# EAGLE design ToolChestAutoLight (EAGLE 9.5.2)
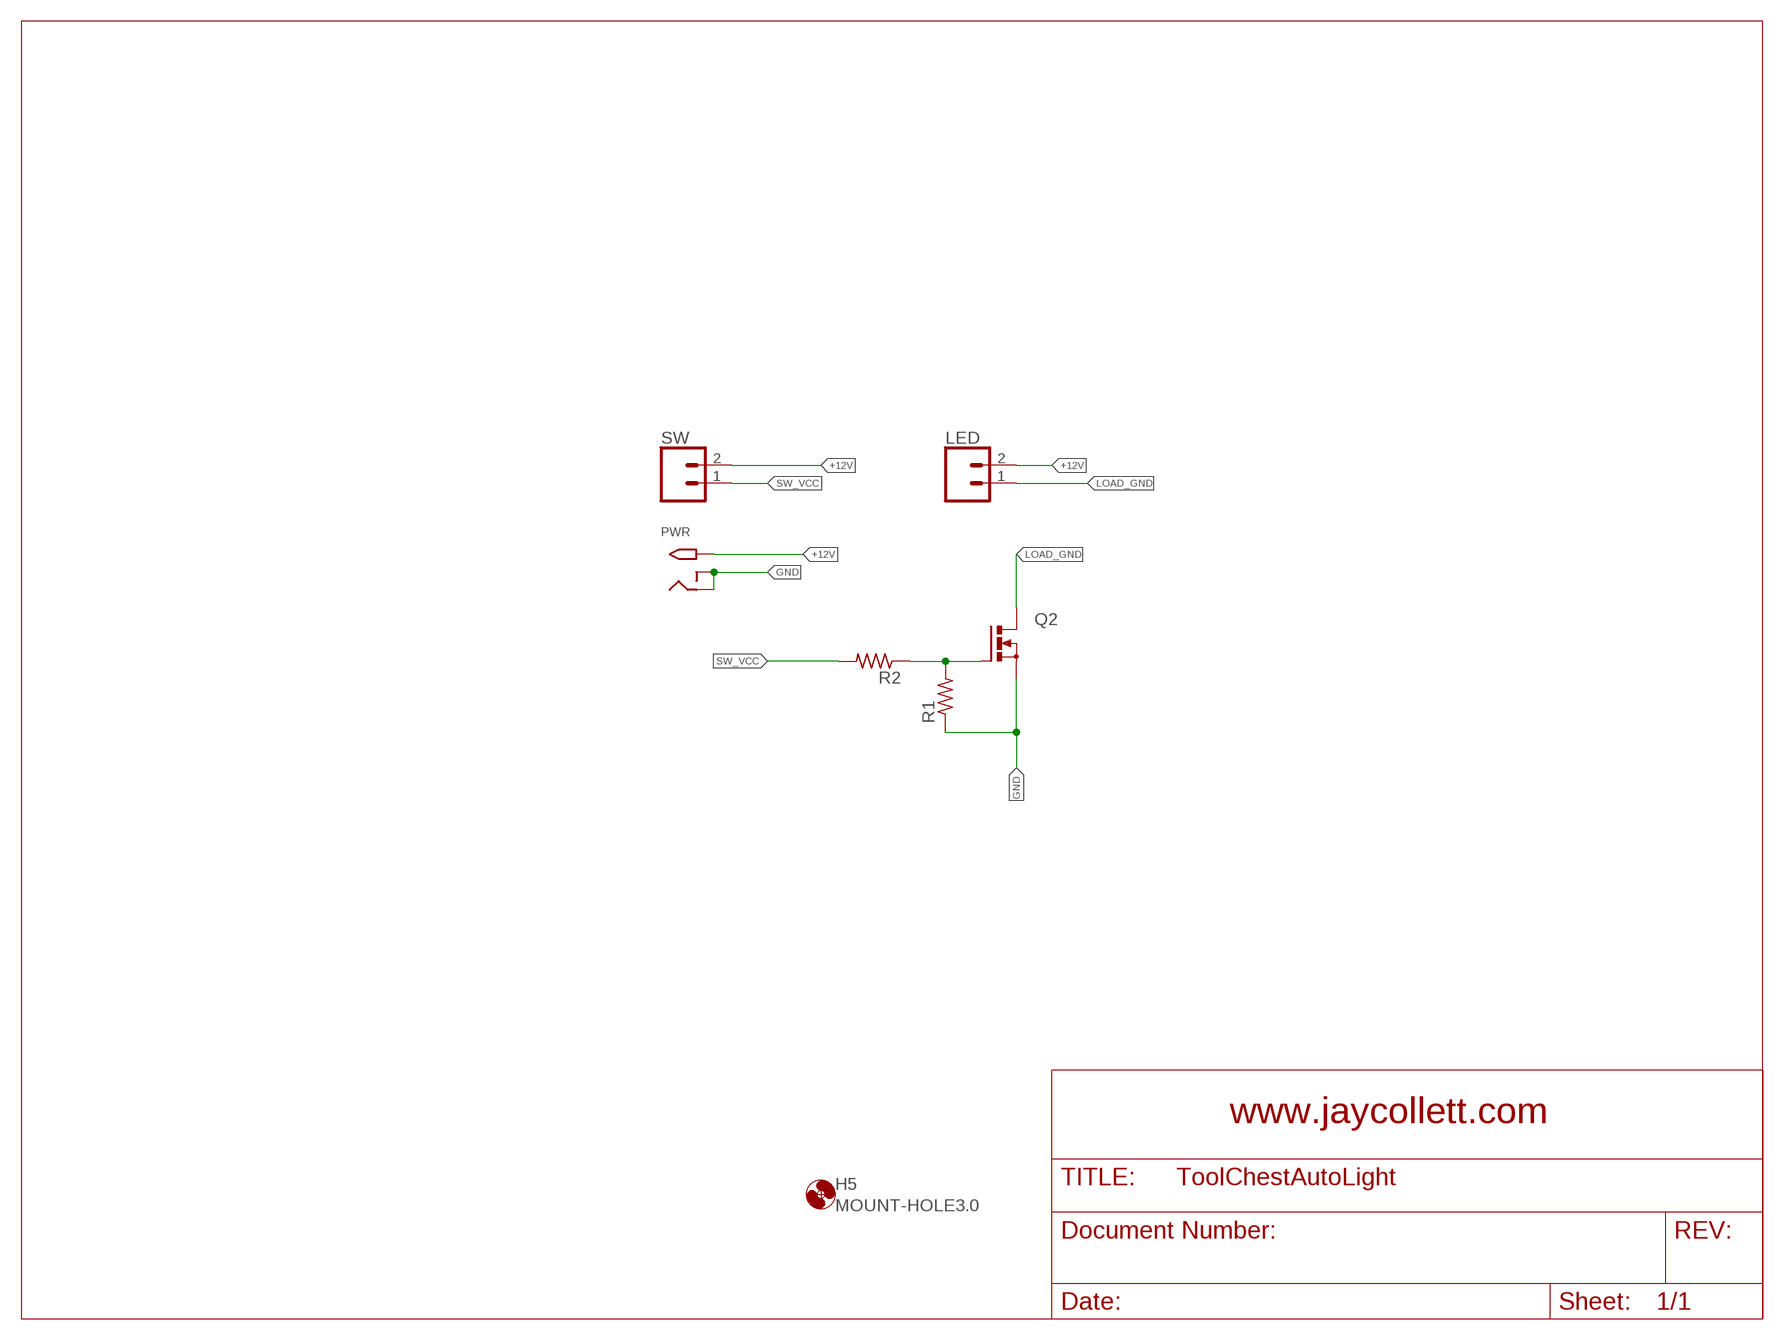
[diagram p0: schematic, sheet 1]

## Parts
H5  MOUNT-HOLE3.0  [3,0]
LED  CONN_02LOCK_LONGPADS  [1X02_LOCK_LONGPADS]
PWR  2.1MMJACKTHM  [PJ-102A]
Q2  PMOSFET_NTO220BH  [TO220BH]
R1  R-US_0204/5  [0204/5]
R2  R-US_0204/5  [0204/5]
SW  CONN_02LOCK_LONGPADS  [1X02_LOCK_LONGPADS]

## Nets
+12V: LED.2 PWR.TIP SW.2
GND: PWR.RING PWR.RING_SW Q2.S R1.1
LOAD_GND: LED.1 Q2.D
N$1: Q2.G R1.2 R2.1
SW_VCC: R2.2 SW.1

## Notes on the sheet
- www.jaycollett.com

## Library data of the parts
H5 = holes:MOUNT-HOLE: MOUNTING HOLE with drill center marker
LED SW = SparkFun-Connectors:CONN_02: Multi connection point. Often used as Generic Header-pin footprint for 0.1 inch spaced/style header connections On any of the 0.1 inch spaced packages, you can populate with these: Break Away Headers - Straight <https://www.sparkfun.com/products/116> (PRT-00116) Break Away Male Headers - Right Angle <https://www.sparkfun.com/products/553> (PRT-00553) Female Headers <https://www.sparkfun.com/products/115> (PRT-00115) Break Away Headers - Machine Pin <https://www.sparkfun.com/products/117> (PRT-00117) Break Away Female Headers - Swiss Machine Pin <https://www.sparkfun.com/products/743> (PRT-00743) For SCREWTERMINALS and SPRING TERMINALS visit here: Screw Terimnals on SparkFun.com <https://www.sparkfun.com/search/results?term=Screw+Terminals> (5mm/3.5mm/2.54mm spacing) This device is also useful as a general connection point to wire up your design to another part of your project. Our various solder wires solder well into these plated through hole pads. Hook-Up Wire - Assortment (Stranded, 22 AWG) <https://www.sparkfun.com/products/11375> (PRT-11375) Hook-Up Wire - Assortment (Solid Core, 22 AWG) <https://www.sparkfun.com/products/11367> (PRT-11367) View the entire wire category on our website here <https://www.sparkfun.com/categories/141> Special notes: Molex polarized connector foot print use with: PRT-08233 with associated crimp pins and housings. 2.54_SCREWTERM for use with PRT-10571. 3.5mm Screw Terminal footprints for PRT-08084 5mm Screw Terminal footprints for use with PRT-08432
PWR = adafruit:2.1MMJACK: 2.1mm x 5.5mm THM DC jack with internal switch. Digikey part #PJ-102A, 4UCON part #05537 2.1mm x 5.5mm SMT DC jack with internal switch. Digikey part #PJ-002A-SMT, 4UCON part #03267 By microbuilder.eu & adafruit.com
Q2 = transistor-power:PMOSFET_N: Power MOSFET N-Channel
R1 R2 = adafruit:R-US_: RESISTOR, American symbol

## Board
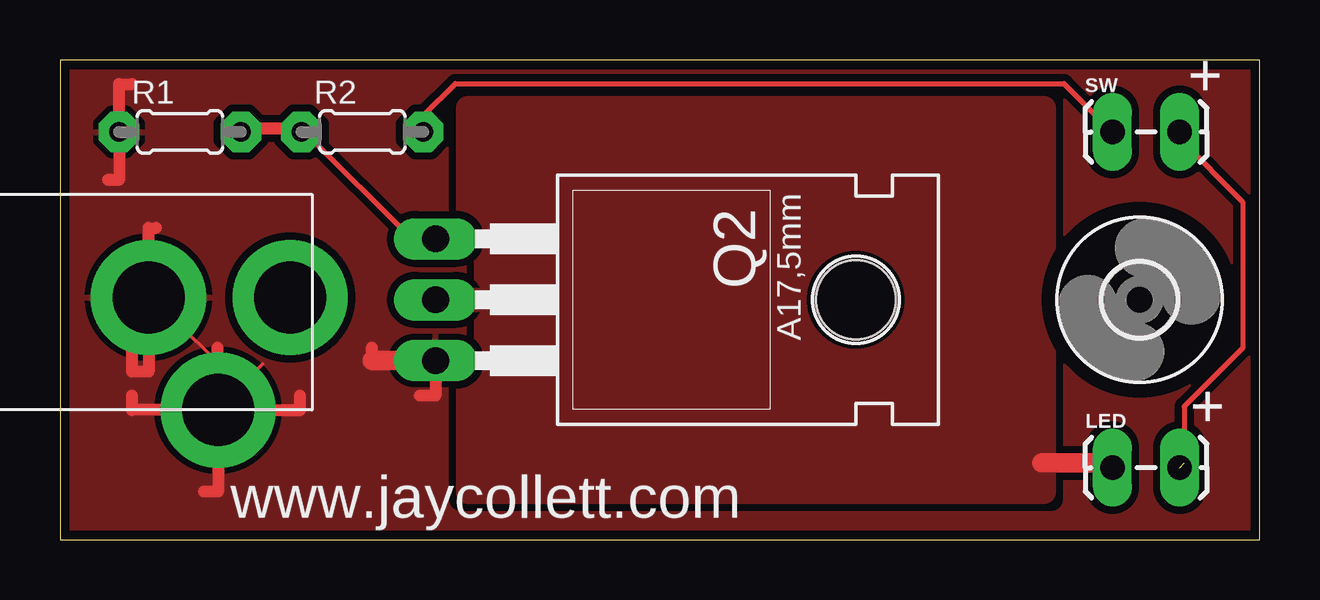
[diagram p1: board, top side]
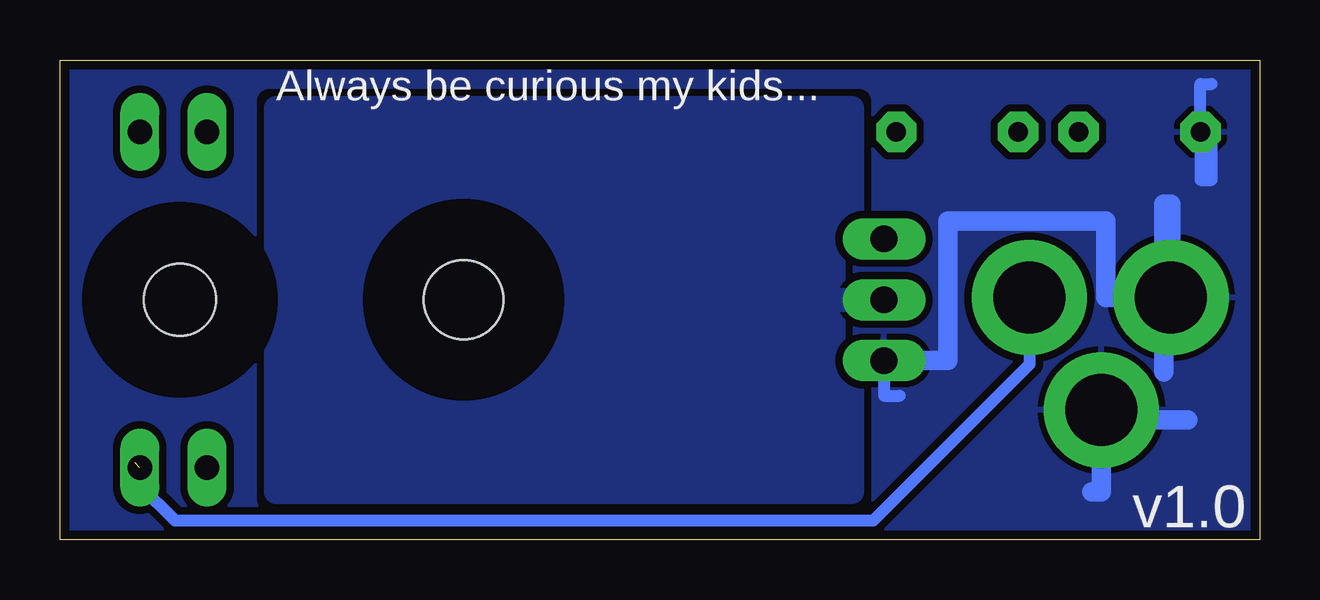
[diagram p2: board, bottom side, seen from below]

Size 50 x 20 mm. Coordinates in mm from the lower left corner, seen from the top.
Outline: 0,0 50,0 50,20 0,20 0,0
Copper layers (1*16): Top 0.035559375mm / dielectric 1.6mm / Bottom 0.035559375mm
Design rules "default *": minimum track width 6mil, minimum drill 10mil, track to track 12mil, track to pad 12mil, pad to pad 12mil, via to via 12mil, smd to smd 12mil, copper to edge 15mil, drill to drill 6mil, minimum pad ring 12mil, minimum via ring 10mil, stop-mask expansion 2.5mil, vias tented up to drill 20mil, thermal gap 10mil

### Footprints (pad centres in the part's own frame; a part is rotated, then mirrored left to right if it is on the bottom)
3,0 = hole 3: 0,0
1X02_LOCK_LONGPADS = drill 1.016 long: 1 -0.127,0; 2 2.667,0
PJ-102A = drill 3 pad 4.8: RING 0.1,-3.39; RING_SW -4.6,-6.29; TIP 0.1,-9.29
TO220BH = drill 1.118 long: D 0,-6.35; G -2.54,-6.35; S 2.54,-6.35 | hole 3.302: 0,11.176
0204/5 = drill 0.813 pad 1.676 octagon: 1 -2.54,0; 2 2.54,0

### Placement (x,y rotation side)
H5  45,10 0 top
LED  44,3 0 top
PWR  0.3,10 90 top
Q2  22,10 270 top
R1  5,17 0 top
R2  12.6,17 0 top
SW  44,17 0 top

### Tracks (layer width: path | path; a pad name or v marks a point on that pad's centre or on a via)
+12V  (1 unrouted)
  Top 0.2: 46.86,3.2 46.86,5.54 49.3,7.98 49.3,14.08 46.67,16.71 SW.2
  Bottom 0.508: PWR.TIP 9.59,7.31 16.1,0.8 45.2,0.8 46.67,2.27 LED.2 | LED.2 46.64,2.97 46.63,2.97 46.63,4 47,4 47,3 LED.2
GND
  Top 0.152: 3.69,10.12 3.66,10.29 | 7.54,6.4 6.63,5.49 PWR.RING_SW 7.54,6.4 | 7.54,6.4 8.46,7.32 | 7.54,6.4 3.89,10.06 PWR.RING
  Top 0.508: 13,7.46 13,8 | Q2.S 15.65,6 15,6 | 2,15 2.46,15 R1.1 2.46,19 3,19 | 4,13 3.69,13 PWR.RING 3.69,7 3,7 3,10.12 3.69,10.12 | PWR.RING_SW 10,5.4 10,6 | PWR.RING_SW 6.59,2 6,2 | PWR.RING_SW 3,5.4 3,6 | PWR.RING_SW 6.59,7.08 6.57,7.08 6.57,8
  Top 0.813: 15.54,7.32 Q2.S 13,7.46
  Bottom 0.508: R1.1 2.46,15 2,15 2,17 R1.1 | R1.1 2.46,19 2,19 | Q2.S 15.65,6 15,6
  Bottom 0.813: Q2.S 13,7.46 13,13.28 6.42,13.28 6.42,10.1 PWR.RING 3.69,14 4,14 4,7 | 3,5 6.59,5 PWR.RING_SW 6.59,2 7,2
  pour Top (isolate 0.015, rank 4): 0,20 0,0 50,0 50,20
  pour Bottom (isolate 0.015, rank 4): 0,20 0,0 50,0 50,20
LOAD_GND
  Top 0.508: 43.66,3.2 LED.1
  Top 0.813: 40.92,3.2 43.66,3.2
  pour Top (isolate 0.015): 17,18 41,18 41,2 17,2
  pour Bottom: 17,18 41,18 41,2 17,2
N$1
  Top 0.152: 7.54,17.14 R1.2 | 10.06,17.14 R2.1 10.29,16.92 | 14.63,12.57 15.54,12.57 Q2.G
  Top 0.2: 10.29,16.92 14.63,12.57
  Top 0.508: 10.06,17.14 7.54,17.14
SW_VCC
  Top 0.152: 43.85,17.02 SW.1
  Top 0.2: 43.85,17.02 41.85,19.02 16.49,19.02 15.14,17.67 R2.2

### Text on the board
tPlace: + | +
tNames: www.jaycollett.com
bNames: Always be curious my kids... | v1.0